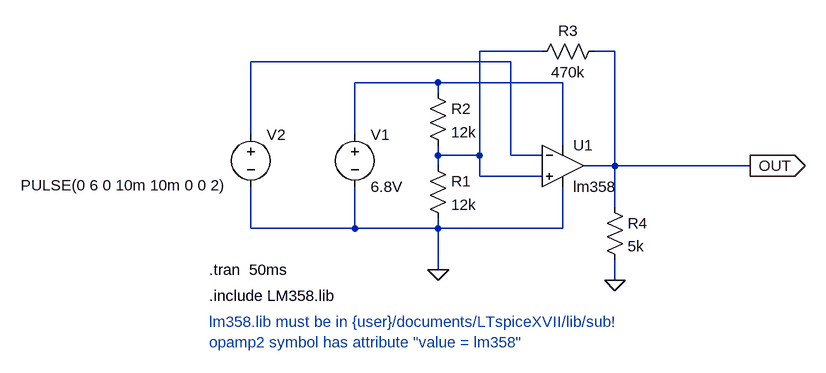
[diagram p0: schematic include_lm358.asc]
include_lm358.asc, the LTspice schematic file:
Version 4
SHEET 1 880 680
WIRE 384 -32 288 -32
WIRE 496 -32 464 -32
WIRE 336 -16 -64 -16
WIRE 224 16 96 16
WIRE 416 16 224 16
WIRE 224 32 224 16
WIRE -64 96 -64 -16
WIRE 96 96 96 16
WIRE 416 112 416 16
WIRE 224 128 224 112
WIRE 288 128 288 -32
WIRE 288 128 224 128
WIRE 336 128 336 -16
WIRE 384 128 336 128
WIRE 224 144 224 128
WIRE 496 144 496 -32
WIRE 496 144 448 144
WIRE 704 144 496 144
WIRE 288 160 288 128
WIRE 384 160 288 160
WIRE 496 208 496 144
WIRE -64 240 -64 176
WIRE 96 240 96 176
WIRE 96 240 -64 240
WIRE 224 240 224 224
WIRE 224 240 96 240
WIRE 416 240 416 176
WIRE 416 240 224 240
WIRE 224 304 224 240
WIRE 496 320 496 288
FLAG 704 144 OUT
IOPIN 704 144 Out
FLAG 224 304 0
FLAG 496 320 0
SYMBOL voltage 96 80 R0
WINDOW 123 0 0 Left 0
WINDOW 39 0 0 Left 0
SYMATTR InstName V1
SYMATTR Value 6.8V
SYMBOL voltage -64 80 R0
WINDOW 123 0 0 Left 0
WINDOW 39 0 0 Left 0
WINDOW 3 -354 94 Left 2
SYMATTR InstName V2
SYMATTR Value PULSE(0 6 0 10m 10m 0 0 2)
SYMBOL res 208 128 R0
SYMATTR InstName R1
SYMATTR Value 12k
SYMBOL res 208 16 R0
SYMATTR InstName R2
SYMATTR Value 12k
SYMBOL res 480 -48 R90
WINDOW 0 0 56 VBottom 2
WINDOW 3 32 56 VTop 2
SYMATTR InstName R3
SYMATTR Value 470k
SYMBOL Opamps\\opamp2 416 80 R0
SYMATTR InstName U1
SYMATTR Value lm358
SYMBOL res 480 192 R0
SYMATTR InstName R4
SYMATTR Value 5k
TEXT -128 304 Left 2 !.tran  50ms
TEXT -128 344 Left 2 !.include LM358.lib
TEXT -128 384 Left 2 ;lm358.lib must be in {user}/documents/LTspiceXVII/lib/sub!\nopamp2 symbol has attribute "value = lm358"

The netlist it stands for:
* include_lm358.asc
V1 N003 0 6.8V
V2 N002 0 PULSE(0 6 0 10m 10m 0 0 2)
R1 N001 0 12k
R2 N003 N001 12k
R3 OUT N001 470k
XU1 N001 N002 N003 0 OUT lm358  ; pins In+ In- V+ V- OUT
R4 OUT 0 5k
.tran  50ms
.include LM358.lib
* lm358.lib must be in {user}/documents/LTspiceXVII/lib/sub!
* opamp2 symbol has attribute "value = lm358"
.backanno
.end